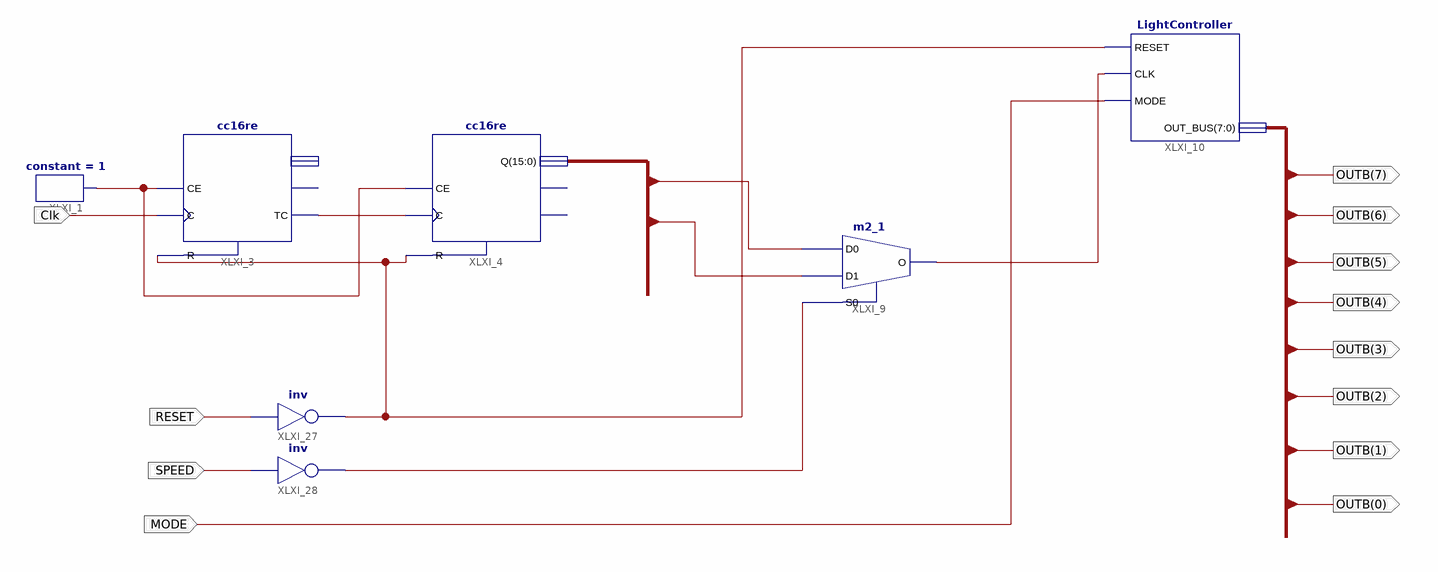
[diagram p0: schematic sheet 1]
// Xilinx ISE schematic TopLevel.sch (spartan3a) as structural Verilog: 7 symbols, 12 ports
module TopLevel (
  input  Clk,
  input  RESET,
  input  SPEED,
  input  MODE,
  output [7:0] OUTB
);

  wire XLXN_13, XLXN_14, XLXN_44, XLXN_76, XLXN_81;
  wire [15:0] Q;

  cc16re XLXI_4 (.C(XLXN_13), .CE(XLXN_14), .R(XLXN_81), .Q(Q));  // open: CEO, TC
  cc16re XLXI_3 (.C(Clk), .CE(XLXN_14), .R(XLXN_81), .TC(XLXN_13));  // open: CEO, Q
  constant #(.CValue("1")) XLXI_1 (.O(XLXN_14));
  m2_1 XLXI_9 (.D0(Q[5]), .D1(Q[4]), .S0(XLXN_76), .O(XLXN_44));
  LightController XLXI_10 (.RESET(XLXN_81), .CLK(XLXN_44), .MODE(MODE), .OUT_BUS(OUTB));
  not XLXI_27 (XLXN_81, RESET);
  not XLXI_28 (XLXN_76, SPEED);
endmodule
